# Altium schematic sheet BoardB-LEDs.SchDoc
size A; SheetNumber: 5; SheetTotal: 7
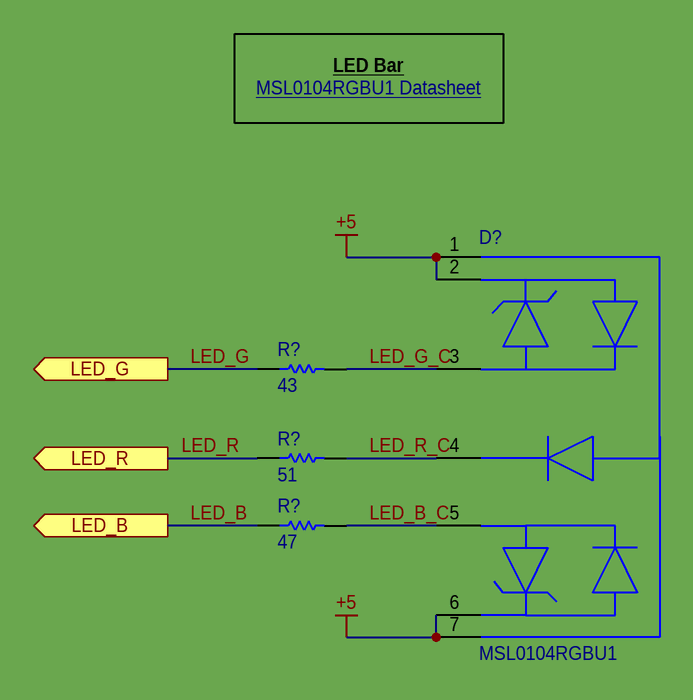
[diagram p0: BoardB-LEDs.SchDoc]

## Parts
(Parts that share a designator on the sheet are numbered #1, #2 ... from top to bottom, then left to right.)
D?  MSL0104RGBU1  [FP-MSL0104-MFG]
R?#1  43  [RESC0603X26X15ML03T05]
R?#2  51  [RESC1608X55X30NL15T15]
R?#3  47  [RESC1608X55X30NL15T15]

## Ports
LED_B (out), LED_G (out), LED_R (out)

## Nets
+5: D?.1(R_A) D?.2(G_A) D?.6(B_A) D?.7(R_A)
LED_B: R?#3.1 ; port LED_B
LED_B_C: D?.5(B_K) R?#3.2
LED_G: R?#1.1 ; port LED_G
LED_G_C: D?.3(G_K) R?#1.2
LED_R: R?#2.1 ; port LED_R
LED_R_C: D?.4(R_K) R?#2.2

## Notes on the sheet
- LED Bar
- MSL0104RGBU1 Datasheet <https://fscdn.rohm.com/en/products/databook/datasheet/opto/led/chip_multi/msl0104rgb-e.pdf>

## Library data of the parts
D? = CMP-08952-000007-1: LED RGB DIFFUSED 2709 SMD R/A; Manufacturer: Rohm; Forward Current: 20mA; Forward Voltage: 2.1/3.3/3.2V; Luminous Intensity: 700/1200/400mcd; Power Dissipation: 400mW; Automotive Grade: NA; Colour: Red, Green, Blue; Wavelength: 624/527/470nm; Led Orientation: Side View; Device Class L2: LEDs; Mouser Description: Standard LEDs - SMD RGB 624/527/470nm 700/1200/400mcd; Lead Free: Yes; Package: MSL0104; RoHS: TRUE; Device Class L3: unset; Manufacturer Part Number: MSL0104RGBU1; Automotive: No; Octopart: https://octopart.com/msl0104rgbu1-rohm-71139759; Temperature Range High: +85°C; ComponentLink2URL: https://www.rohm.com/datasheet/MSL0104RGBU/msl0104rgb-e; ComponentLink2Description: Datasheet; Category: Diode; Temperature: -40°C to +85°C; Temperature Range Low: -40°C; Height: 2.35mm; Digikey Description: LED RGB DIFFUSED 2709 SMD R/A; Device Class L1: Optoelectronics
R?#1 = CMP-2004-03548-1: Manufacturer: Panasonic; Part Number: ERJ1GNF43R0C
R?#2 = CMP-2000-00547-1: Part Number: ERJ3EKF51R0V; Manufacturer: Panasonic
R?#3 = CMP-2000-00529-2: Chip Resistor, 47 Ohm, +/- 1%, 0.1 W, -55 to 155 degC, 0603 (1608 Metric), RoHS, Tape and Reel; Power Rating: 100 mW; Case\Package: 0603; Voltage Rating (DC): 50 V; Resistance: 6.8 kohm; Length: 1.6 mm; Case Code (Metric): 1608; Packaging: Tape and Reel; Min Operating Temperature: -55 degC; DatasheetVersion: Apr-15; PackageReference: 0603; Case Code (Imperial): 0603; PackageDescription: 2-Pin Surface Mount Device, Body 1.6 x 0.85 mm; Tolerance: 1%; Height: 0.45 mm; RoHSCompliant: true; ComponentLink2Description: Datasheet; Pins: 2; ComponentLink1URL: http://www.panasonic.com/; Package Quantity: 5000; REACH SVHC: No SVHC; ComponentLink2URL: http://industrial.panasonic.com/cdbs/www-data/pdf/RDA0000/AOA0000C86.pdf; Width: 0.8 mm; Mount: Surface Mount; Max Operating Temperature: 155 degC; ComponentLink1Description: Manufacturer URL; Voltage Rating: 50 V